# Altium schematic sheet PowerSupply.SchDoc
size A4; SheetNumber: 3; SheetTotal: 5
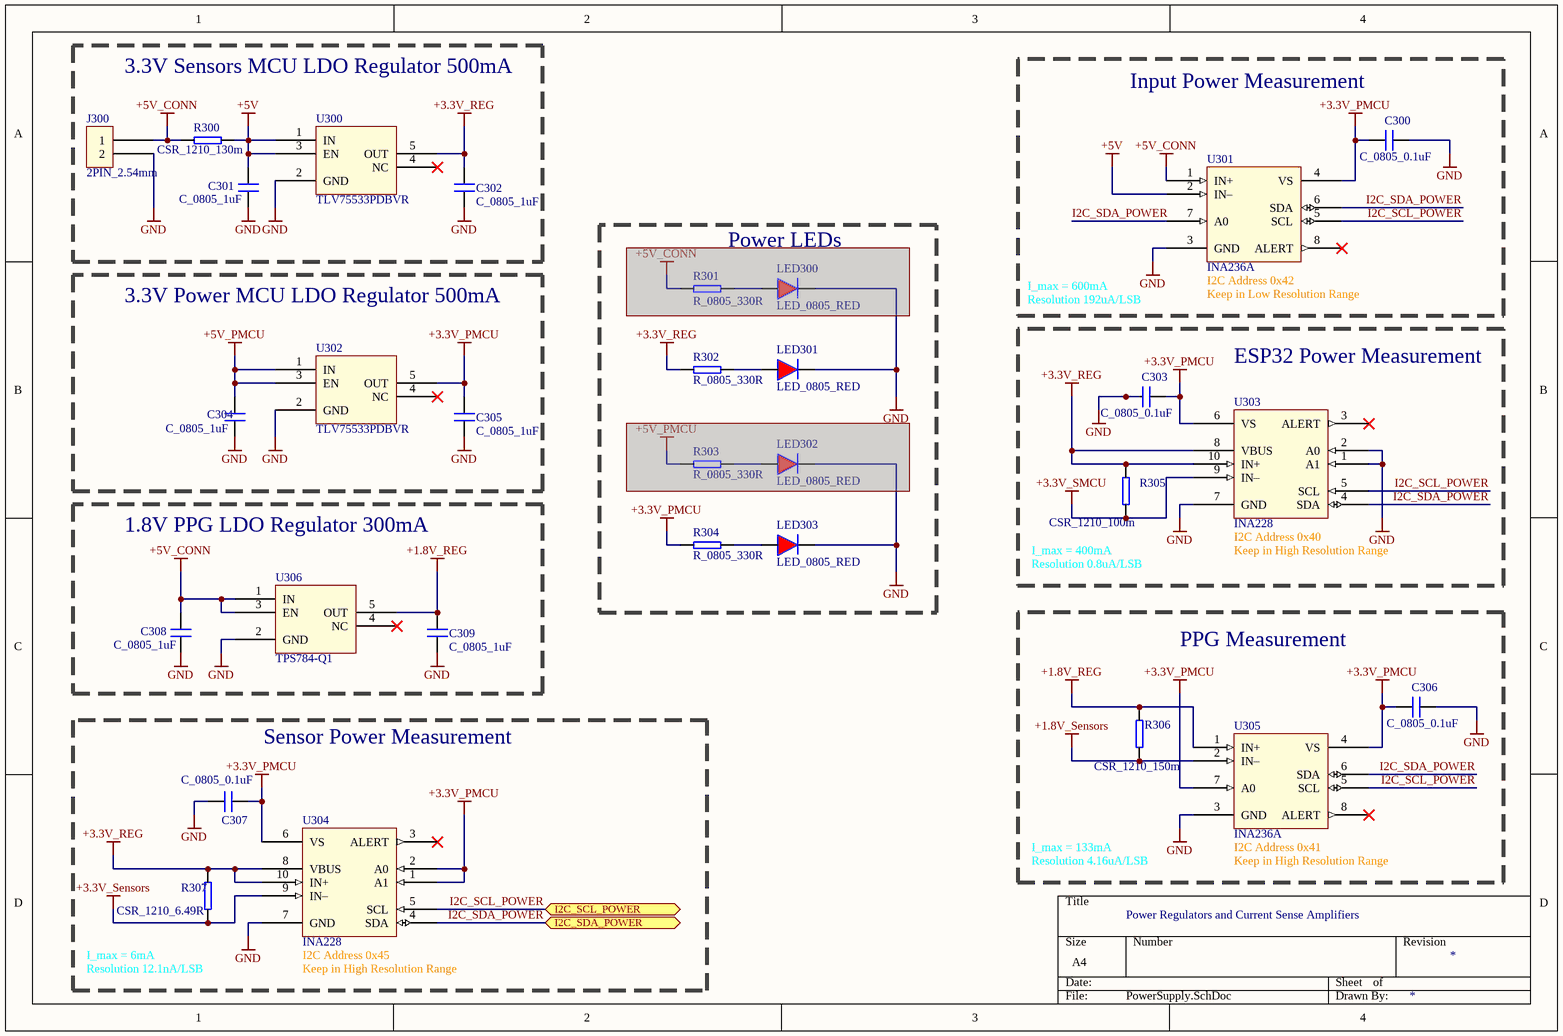
[diagram p0: PowerSupply.SchDoc]

## Parts
C300  C_0805_0.1uF  [CAP_0805]
C301  C_0805_1uF  [CAP_0805]
C302  C_0805_1uF  [CAP_0805]
C303  C_0805_0.1uF  [CAP_0805]
C304  C_0805_1uF  [CAP_0805]
C305  C_0805_1uF  [CAP_0805]
C306  C_0805_0.1uF  [CAP_0805]
C307  C_0805_0.1uF  [CAP_0805]
C308  C_0805_1uF  [CAP_0805]
C309  C_0805_1uF  [CAP_0805]
J300  2PIN_2.54mm  [2PIN_2.54mm-Footprint-1]
LED300  LED_0805_RED  [LED_0806]  (masked out: inside a compile mask, not in the netlist)
LED301  LED_0805_RED  [LED_0806]
LED302  LED_0805_RED  [LED_0806]  (masked out: inside a compile mask, not in the netlist)
LED303  LED_0805_RED  [LED_0806]
R300  CSR_1210_130m  [CSR_1210]
R301  R_0805_330R  [0805_RES]  (masked out: inside a compile mask, not in the netlist)
R302  R_0805_330R  [0805_RES]
R303  R_0805_330R  [0805_RES]  (masked out: inside a compile mask, not in the netlist)
R304  R_0805_330R  [0805_RES]
R305  CSR_1210_100m  [CSR_1210]
R306  CSR_1210_150m  [CSR_1210]
R307  CSR_1210_6.49R  [CSR_1210]
U300  TLV75533PDBVR  [SOT95P280X145-5N]
U301  INA236A  [INA236A-Footprint-1]
U302  TLV75533PDBVR  [SOT95P280X145-5N]
U303  INA228  [TSSOP50P490X110-10N]
U304  INA228  [TSSOP50P490X110-10N]
U305  INA236A  [INA236A-Footprint-1]
U306  TPS784-Q1  [SOT95P280X145-5N]

## Blocks framed on the sheet
3.3V Sensors MCU LDO Regulator 500mA: C301 C302 J300 R300 U300
Input Power Measurement: C300 U301
Power LEDs: LED300-LED303 R301-R304
3.3V Power MCU LDO Regulator 500mA: C304 C305 U302
ESP32 Power Measurement: C303 R305 U303
1.8V PPG LDO Regulator 300mA: C308 C309 U306
PPG Measurement: C306 R306 U305
Sensor Power Measurement: C307 R307 U304

## Ports
I2C_SCL_POWER (bidir, see Sensors_Power_Characterisation_Board[2A], MCU_power[1A]), I2C_SDA_POWER (bidir, see Sensors_Power_Characterisation_Board[2A], MCU_power[1A])

## Nets
+1.8V_REG: C309.2 R306.1 U305.1(IN+) U306.5(OUT)
+1.8V_Sensors: R306.2 U305.2(IN–)
+3.3V_PMCU: C300.1 C303.2 C305.2 C306.1 C307.1 R304.2 U301.4(VS) U302.5(OUT) U303.6(VS) U304.1(A1) U304.2(A0) U304.6(VS) U305.4(VS) U305.7(A0)
+3.3V_REG: C302.2 R302.2 R305.1 R307.1 U300.5(OUT) U303.8(VBUS) U303.10(IN+) U304.8(VBUS) U304.10(IN+)
+3.3V_Sensors: R307.2 U304.9(IN–)
+3.3V_SMCU: R305.2 U303.9(IN–)
+5V: C301.2 R300.1 U300.1(IN) U300.3(EN) U301.2(IN–)
+5V_CONN: C308.2 J300.1 R300.2 U301.1(IN+) U306.1(IN) U306.3(EN)
+5V_PMCU: C304.2 U302.1(IN) U302.3(EN)
GND: C300.2 C301.1 C302.1 C303.1 C304.1 C305.1 C306.2 C307.2 C308.1 C309.1 J300.2 LED301.1 LED303.1 U300.2(GND) U301.3(GND) U302.2(GND) U303.1(A1) U303.2(A0) U303.7(GND) U304.7(GND) U305.3(GND) U306.2(GND)
I2C_SCL_POWER: U301.5(SCL) U303.5(SCL) U304.5(SCL) U305.5(SCL) ; port I2C_SCL_POWER
I2C_SDA_POWER: U301.6(SDA) U301.7(A0) U303.4(SDA) U304.4(SDA) U305.6(SDA) ; port I2C_SDA_POWER
NetLED301_2: LED301.2 R302.1
NetLED303_2: LED303.2 R304.1

Not connected (* = marked no-connect by the designer): U300 4(NC)*; U301 8(ALERT)*; U302 4(NC)*; U303 3(ALERT)*; U304 3(ALERT)*; U305 8(ALERT)*; U306 4(NC)*

## Notes on the sheet
- Resolution 192uA/LSB
- I_max = 600mA
- (near U301) I2C Address 0x42
- (near U301) Keep in Low Resolution Range
- Resolution 0.8uA/LSB
- (near R305) I_max = 400mA
- (near U303) I2C Address 0x40
- (near U303) Keep in High Resolution Range
- I_max = 133mA
- (near U305) I2C Address 0x41
- Resolution 4.16uA/LSB
- Power Regulators and Current Sense Amplifiers
- (near U305) Keep in High Resolution Range
- Resolution 12.1nA/LSB
- I_max = 6mA
- (near U304) I2C Address 0x45
- (near U304) Keep in High Resolution Range

## Library data of the parts
C300 C303 C306 C307 = CMP-00002-3: JLC Part Number: C28233
C301 C302 C304 C305 C308 C309 = CMP-00004-3: JLC Part Number: C28323
J300 = CMP-00018-3: 2 pin power input; JLC Part Number: C5360898
LED300-LED303 = CMP-00021-4: LED, Red, SMD, 0805 [2012 Metric], 30 mA, 2 V, 625 nm; Order Code: 2322077; Distributor: Farnell; JLC Part Number: C94741
R300 = CMP-00045-3: Current Sense Resistors - SMD RLC73K 2E R13 1% 1K RL  RLC73K2ER13FTDF; Order Code: 279-RLC73K2ER13FTDF; Distributor: Mouser; JLC Part Number: C175909
R301-R304 = CMP-00022-2: JLC Part Number: C17630
R305 = CMP-00046-2: Current Sense Resistors - SMD RLC73PW 2E R10 1% 1K RL, RLC73PW2ER10FTDF; Order Code: 279-RLC73PW2ER10FTDF; Distributor: Mouser; JLC Part Number: C160924
R306 = CMP-00035-2: Current Sense Resistors - SMD RL73H 2E R15 1%5K RL, 150mOhms; Order Code: 279-RL73H2ER15FTD; Distributor: Mouser; JLC Part Number: C186626
R307 = CMP-00044-2: Current Sense Resistors - SMD 6.49ohms 1% 100 PPM SR732ETTE6R49F; Order Code: 660-SR732ETTE6R49F; Distributor: Mouser
U300 U302 = CMP-00019-2: LDO Voltage Regulators 500-mA high-PSRR low-IQ low-dropout voltage regulator with enable 5-SOT-23 -40 to 125; JLC Part Number: C404027
U301 U305 = CMP-00031-4: Current & Power Monitors & Regulators 48-V, 16-bit ultraprecise I²C output digital power monitor with alert in WCSP 8-SOT-23-THIN -40 to 125; Order Code: 595-INA236AIDDFR; Distributor: Mouser; JLC Part Number: C5443912
U303 U304 = CMP-00042-2: Current & Power Monitors & Regulators AEC-Q100, 85-V, 20-bit, ultraprecise, I²C output current/voltage/power/energy/charge monitor 10-VSSOP -40 to 125; Order Code: 595-INA228AQDGSRQ1; Distributor: Mouser
U306 = CMP-00023-2: LDO Voltage Regulators Automotive, 300-mA, low-IQ, high-PSRR, LDO voltage regulator with high accuracy and enable 5-SOT-23 -40 to 150; Order Code: 595-TPS78418QDBVRQ1; Distributor: Mouser; JLC Part Number: C2877783